# EAGLE schematic MacroMicro_v27 (EAGLE 9.7.0)
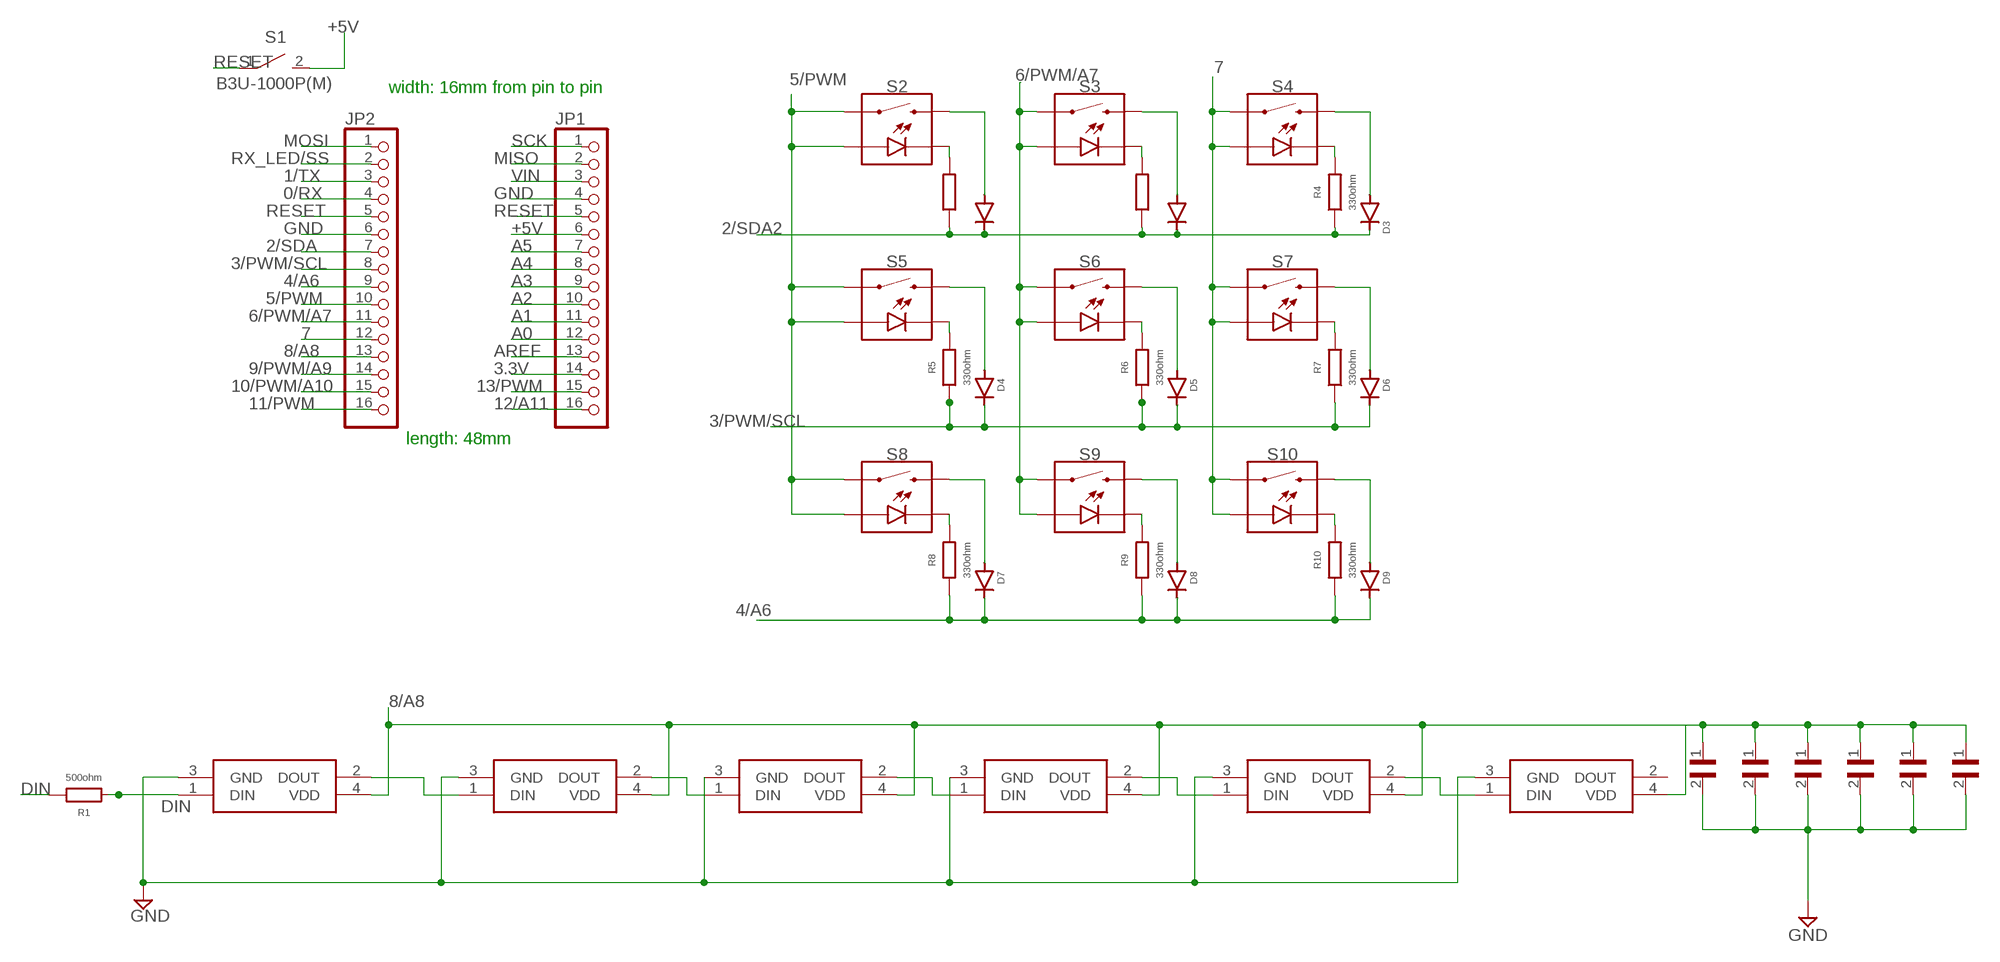
[diagram p0: schematic, sheet 1]

## Parts
C1  0.1uf  0603Y0500104KET  [CAPC1608X80N]
C2  0.1uf  0603Y0500104KET  [CAPC1608X80N]
C3  0.1uf  0603Y0500104KET  [CAPC1608X80N]
C4  0.1uf  0603Y0500104KET  [CAPC1608X80N]
C5  0.1uf  0603Y0500104KET  [CAPC1608X80N]
C6  0.1uf  0603Y0500104KET  [CAPC1608X80N]
D1  1N4148WS  [SOD-323]
D2  1N4148WS  [SOD-323]
D3  1N4148WS  [SOD-323]
D4  1N4148WS  [SOD-323]
D5  1N4148WS  [SOD-323]
D6  1N4148WS  [SOD-323]
D7  1N4148WS  [SOD-323]
D8  1N4148WS  [SOD-323]
D9  1N4148WS  [SOD-323]
JP1  PINHD-1X16  [1X16]
JP2  PINHD-1X16  [1X16]
LED1  SK6812MINI-E  [SK6812MINIE]
LED2  SK6812MINI-E  [SK6812MINIE]
LED3  SK6812MINI-E  [SK6812MINIE]
LED4  SK6812MINI-E  [SK6812MINIE]
LED5  SK6812MINI-E  [SK6812MINIE]
LED6  SK6812MINI-E  [SK6812MINIE]
R1  500ohm  R_CHIP-1206(3216-METRIC)  [RESC3216X70]
R2  330ohm  R_CHIP-1206(3216-METRIC)  [RESC3216X70]
R3  330ohm  R_CHIP-1206(3216-METRIC)  [RESC3216X70]
R4  330ohm  R_CHIP-1206(3216-METRIC)  [RESC3216X70]
R5  330ohm  R_CHIP-1206(3216-METRIC)  [RESC3216X70]
R6  330ohm  R_CHIP-1206(3216-METRIC)  [RESC3216X70]
R7  330ohm  R_CHIP-1206(3216-METRIC)  [RESC3216X70]
R8  330ohm  R_CHIP-1206(3216-METRIC)  [RESC3216X70]
R9  330ohm  R_CHIP-1206(3216-METRIC)  [RESC3216X70]
R10  330ohm  R_CHIP-1206(3216-METRIC)  [RESC3216X70]
S1  B3U-1000P(M)  B3U-X000B3U-1000P(M)1000P(M)  [B3U-1000P(M)]
S2  MOMENTARY-SWITCH-SPST-LED-PTH-CHERRY  [CHERRY-MX-LED]
S3  MOMENTARY-SWITCH-SPST-LED-PTH-CHERRY  [CHERRY-MX-LED]
S4  MOMENTARY-SWITCH-SPST-LED-PTH-CHERRY  [CHERRY-MX-LED]
S5  MOMENTARY-SWITCH-SPST-LED-PTH-CHERRY  [CHERRY-MX-LED]
S6  MOMENTARY-SWITCH-SPST-LED-PTH-CHERRY  [CHERRY-MX-LED]
S7  MOMENTARY-SWITCH-SPST-LED-PTH-CHERRY  [CHERRY-MX-LED]
S8  MOMENTARY-SWITCH-SPST-LED-PTH-CHERRY  [CHERRY-MX-LED]
S9  MOMENTARY-SWITCH-SPST-LED-PTH-CHERRY  [CHERRY-MX-LED]
S10  MOMENTARY-SWITCH-SPST-LED-PTH-CHERRY  [CHERRY-MX-LED]

## Nets
0/RX: JP2.4
1/TX: JP2.3
2/SDA: JP2.7
2/SDA2: D1.C D2.C D3.C R2.1 R3.1 R4.1
3.3V: JP1.14
3/PWM/SCL: D4.C D5.C D6.C JP2.8 R5.1 R6.1 R7.1
4/A6: D7.C D8.C D9.C JP2.9 R8.1 R9.1 R10.1
5/PWM: JP2.10 S2.A S2.S1 S5.A S5.S1 S8.A S8.S1
6/PWM/A7: JP2.11 S3.A S3.S1 S6.A S6.S1 S9.A S9.S1
7: JP2.12 S4.A S4.S1 S7.A S7.S1 S10.A S10.S1
8/A8: C1.1 C2.1 C3.1 C4.1 C5.1 C6.1 JP2.13 LED1.4(VDD) LED2.4(VDD) LED3.4(VDD) LED4.4(VDD) LED5.4(VDD) LED6.4(VDD)
9/PWM/A9: JP2.14
10/PWM/A10: JP2.15
11/PWM: JP2.16
12/A11: JP1.16
13/PWM: JP1.15
+5V: JP1.6 S1.2
A0: JP1.12
A1: JP1.11
A2: JP1.10
A3: JP1.9
A4: JP1.8
A5: JP1.7
AREF: JP1.13
DIN: LED1.1(DIN) R1.1 R1.2
GND: C1.2 C2.2 C3.2 C4.2 C5.2 C6.2 JP1.4 JP2.6 LED1.3(GND) LED2.3(GND) LED3.3(GND) LED4.3(GND) LED5.3(GND) LED6.3(GND)
MISO: JP1.2
MOSI: JP2.1
N$1: D1.A S2.S2
N$2: D2.A S3.S2
N$4: R3.2 S3.K(C)
N$5: D3.A S4.S2
N$6: R4.2 S4.K(C)
N$7: D4.A S5.S2
N$8: R5.2 S5.K(C)
N$9: D5.A S6.S2
N$10: LED1.2(DOUT) LED2.1(DIN)
N$11: R2.2 S2.K(C)
N$12: R6.2 S6.K(C)
N$13: LED2.2(DOUT) LED3.1(DIN)
N$14: D6.A S7.S2
N$15: R7.2 S7.K(C)
N$16: LED3.2(DOUT) LED4.1(DIN)
N$17: D7.A S8.S2
N$18: R8.2 S8.K(C)
N$19: D8.A S9.S2
N$20: R9.2 S9.K(C)
N$21: D9.A S10.S2
N$22: R10.2 S10.K(C)
N$23: LED4.2(DOUT) LED5.1(DIN)
N$24: LED5.2(DOUT) LED6.1(DIN)
RESET: JP1.5 JP2.5 S1.1
RX_LED/SS: JP2.2
SCK: JP1.1
VIN: JP1.3
Unconnected: LED6.2(DOUT)

## Notes on the sheet
- width: 16mm from pin to pin
- length: 48mm

## Library data of the parts
C1-C6 = C0,1uf/100nf:0603Y0500104KET; DESCRIPTION: 0.1µF ±10% 50V Ceramic Capacitor X7R (2R1) 0603 (1608 Metric); DIGI-KEY_PART_NUMBER: 1608-1306-1-ND; MF: Knowles Syfer; MP: 0603Y0500104KET; PACKAGE: 1608 Knowles Syfer; PURCHASE-URL: https://pricing.snapeda.com/search/part/0603Y0500104KET/?ref=eda
D1-D9 = Diodes:1N4148WS: DIODE GEN PURP 75V 150MA SOD323F Manufacturer's datasheet <https://www.onsemi.com/pub/Collateral/1N914BWS-D.pdf>; CREATED_BY: PCBLayout.com; DIGIKEY_PART_NUMBER: 1N4148WSFSTR-ND; MANUFACTURER: Diodes Incorporated; MPN: 1N4148WS; PACKAGE: SOD-323
JP1 JP2 = Connector:PINHD-1X16: PIN HEADER; CATEGORY: CONNECTOR; SUB-CATEGORY: PIN-HEADER
LED1-LED6 = LED-SK6812MINI-E:SK6812MINI-E: 3.2x2.8x1.78 mm 0.2W Intelligent external control surface mount SMD LED (MSL:5a) Source: Datasheet <http://yushakobo.jp/ds/YS-SK6812MINI-E.pdf>
R1-R10 = Resistor:R: Resistor Fixed - Generic; CATEGORY: Resistor; SUB-CATEGORY: Fixed
S1 = Switch:B3U-X000: Ultra-small Tactile Switch Contact form : SPST-NO Datasheet <https://omronfs.omron.com/en_US/ecb/products/pdf/en-b3u.pdf>; CATEGORY: SWITCH; DESCRIPTION: Ultra-small Surface-mounting Tactile Switches with High Contact Reliability; MANUFACTURER: OMRON; OPERATING_TEMPERATURE: -25°C to +70°C at 60%RH max; PART_STATUS: ACTIVE; ROHS_COMPLIANCE: RoHS Compliant; SERIES: B3U; TYPE: Tactile
S2-S10 = SparkFun-Switches:MOMENTARY-SWITCH-SPST-LED: Momentary Switch (Pushbutton) - SPST - w/ LED Normally-open (NO) SPST momentary switches (buttons, pushbuttons), with a built-in LED. Variants PTH-CHERRY - Cherry MX Switch Cherry MX Keyswitches are top-of-the-line mechanical keyboard switches. They’re satisfyingly “clicky”, reliable up to tens-of-millions of key presses, and a standard in gaming and programming keyboards across the globe. This ‘blue’ version Cherry MX Switch is favored by most due to its secondary internal actuator making it less likely to “double-tap.” If you are looking for a noticeably audible and high-quality key switch, this is the perfect option for you! Cherry MX Switch <https://www.sparkfun.com/products/13834> (COM-13834) Cherry MX Switch Breakout <https://www.sparkfun.com/products/13773> (BOB-13773) PTH-12MM and PTH-12MM-KIT - 12mm Illuminated LED KIT variant is for soldering kits. There is no tStop (covering up the top side of the pads with mask). This helps the beginner see which side they should be soldering too. LED Tactile Button Breakout <https://www.sparkfun.com/products/10467> (BOB-10467) LED Tactile Button - Red <https://www.sparkfun.com/products/10442> (COM-10442) LED Tactile Button - Blue <https://www.sparkfun.com/products/10443> (COM-10443) LED Tactile Button - Green <https://www.sparkfun.com/products/10440> (COM-10440) LED Tactile Button - Orange <https://www.sparkfun.com/products/10441> (COM-10441) LED Tactile Button - White <https://www.sparkfun.com/products/10439> (COM-10439); SF_ID: COM-13834